# Altium schematic sheet support.SchDoc: Support
size A4; DrawnBy: Adrianna Ascalon
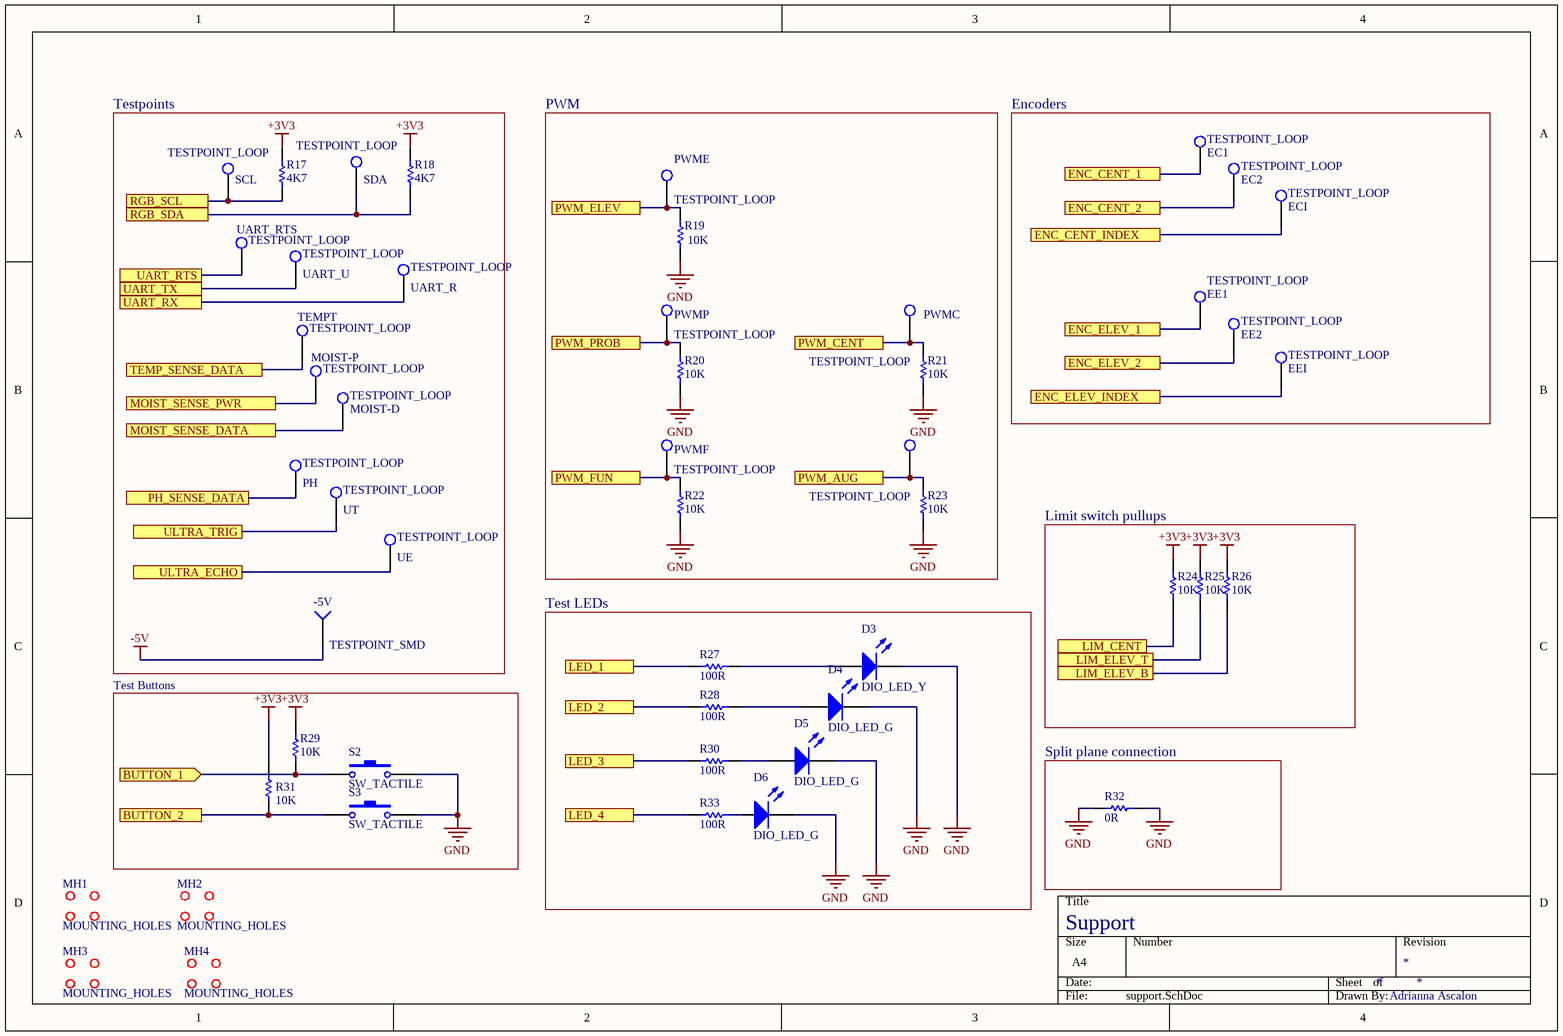
[diagram p0: support.SchDoc]

## Parts
-5V  TESTPOINT_SMD  [TESTPOINT]
D3  DIO_LED_Y  [LED_0805_LINE]
D4  DIO_LED_G  [LED_0805_LINE]
D5  DIO_LED_G  [LED_0805_LINE]
D6  DIO_LED_G  [LED_0805_LINE]
EC1  TESTPOINT_LOOP  [TESTPOINT_LOOP]
EC2  TESTPOINT_LOOP  [TESTPOINT_LOOP]
ECI  TESTPOINT_LOOP  [TESTPOINT_LOOP]
EE1  TESTPOINT_LOOP  [TESTPOINT_LOOP]
EE2  TESTPOINT_LOOP  [TESTPOINT_LOOP]
EEI  TESTPOINT_LOOP  [TESTPOINT_LOOP]
MH1  MOUNTING_HOLES  [MOUNTING_HOLE]
MH2  MOUNTING_HOLES  [MOUNTING_HOLE]
MH3  MOUNTING_HOLES  [MOUNTING_HOLE]
MH4  MOUNTING_HOLES  [MOUNTING_HOLE]
MOIST-D  TESTPOINT_LOOP  [TESTPOINT_LOOP]
MOIST-P  TESTPOINT_LOOP  [TESTPOINT_LOOP]
PH  TESTPOINT_LOOP  [TESTPOINT_LOOP]
PWMA  TESTPOINT_LOOP  [TESTPOINT_LOOP]
PWMC  TESTPOINT_LOOP  [TESTPOINT_LOOP]
PWME  TESTPOINT_LOOP  [TESTPOINT_LOOP]
PWMF  TESTPOINT_LOOP  [TESTPOINT_LOOP]
PWMP  TESTPOINT_LOOP  [TESTPOINT_LOOP]
R17  value 4K7  [RESC0603(1608)_N]  (hidden comment: RES_4K7_0603)
R18  value 4K7  [RESC0603(1608)_N]  (hidden comment: RES_4K7_0603)
R19  value 10K  [RESC0603(1608)_N]  (hidden comment: RES_10K_0603)
R20  value 10K  [RESC0603(1608)_N]  (hidden comment: RES_10K_0603)
R21  value 10K  [RESC0603(1608)_N]  (hidden comment: RES_10K_0603)
R22  value 10K  [RESC0603(1608)_N]  (hidden comment: RES_10K_0603)
R23  value 10K  [RESC0603(1608)_N]  (hidden comment: RES_10K_0603)
R24  value 10K  [RESC0603(1608)_N]  (hidden comment: RES_10K_0603)
R25  value 10K  [RESC0603(1608)_N]  (hidden comment: RES_10K_0603)
R26  value 10K  [RESC0603(1608)_N]  (hidden comment: RES_10K_0603)
R27  value 100R  [RESC0603(1608)_N]  (hidden comment: RES_100R_0603)
R28  value 100R  [RESC0603(1608)_N]  (hidden comment: RES_100R_0603)
R29  value 10K  [RESC0603(1608)_N]  (hidden comment: RES_10K_0603)
R30  value 100R  [RESC0603(1608)_N]  (hidden comment: RES_100R_0603)
R31  value 10K  [RESC0603(1608)_N]  (hidden comment: RES_10K_0603)
R32  value 0R  [RESC0603(1608)_N]  (hidden comment: RES_0R_0603)
R33  value 100R  [RESC0603(1608)_N]  (hidden comment: RES_100R_0603)
S2  SW_TACTILE  [B3U-1100P]
S3  SW_TACTILE  [B3U-1100P]
SCL  TESTPOINT_LOOP  [TESTPOINT_LOOP]
SDA  TESTPOINT_LOOP  [TESTPOINT_LOOP]
TEMPT  TESTPOINT_LOOP  [TESTPOINT_LOOP]
UART_R  TESTPOINT_LOOP  [TESTPOINT_LOOP]
UART_RTS  TESTPOINT_LOOP  [TESTPOINT_LOOP]
UART_U  TESTPOINT_LOOP  [TESTPOINT_LOOP]
UE  TESTPOINT_LOOP  [TESTPOINT_LOOP]
UT  TESTPOINT_LOOP  [TESTPOINT_LOOP]

## Blocks framed on the sheet
Testpoints: -5V MOIST-D MOIST-P PH R17 R18 SCL SDA TEMPT UART_R UART_RTS UART_U UE UT
PWM: PWMA PWMC PWME PWMF PWMP R19-R23
Encoders: EC1 EC2 ECI EE1 EE2 EEI
Limit switch pullups: R24-R26
Test LEDs: D3-D6 R27 R28 R30 R33
Test Buttons: R29 R31 S2 S3
Split plane connection: R32

## Ports
BUTTON_1 (in), BUTTON_2, ENC_CENT_1, ENC_CENT_2, ENC_CENT_INDEX, ENC_ELEV_1, ENC_ELEV_2, ENC_ELEV_INDEX, LED_1, LED_2, LED_3, LED_4, LIM_CENT, LIM_ELEV_B, LIM_ELEV_T, MOIST_SENSE_DATA, MOIST_SENSE_PWR, PH_SENSE_DATA, PWM_AUG, PWM_CENT, PWM_ELEV, PWM_FUN, PWM_PROB, RGB_SCL, RGB_SDA, TEMP_SENSE_DATA, UART_RTS, UART_RX, UART_TX, ULTRA_ECHO, ULTRA_TRIG

## Nets
+3V3: R17.2 R18.2 R24.2 R25.2 R26.2 R29.2 R31.1
-5V: -5V.1(=value)
GND: D3.2(K) D4.2(K) D5.2(K) D6.2(K) R19.1 R20.1 R21.1 R22.1 R23.1 R32.1 R32.2 S2.2 S3.2
BUTTON_1: R29.1 S2.1 ; port BUTTON_1
BUTTON_2: R31.2 S3.1 ; port BUTTON_2
ENC_CENT_1: EC1.1(=value) ; port ENC_CENT_1
ENC_CENT_2: EC2.1(=value) ; port ENC_CENT_2
ENC_CENT_INDEX: ECI.1(=value) ; port ENC_CENT_INDEX
ENC_ELEV_1: EE1.1(=value) ; port ENC_ELEV_1
ENC_ELEV_2: EE2.1(=value) ; port ENC_ELEV_2
ENC_ELEV_INDEX: EEI.1(=value) ; port ENC_ELEV_INDEX
LED_1: R27.1 ; port LED_1
LED_2: R28.1 ; port LED_2
LED_3: R30.1 ; port LED_3
LED_4: R33.1 ; port LED_4
LIM_CENT: R24.1 ; port LIM_CENT
LIM_ELEV_B: R26.1 ; port LIM_ELEV_B
LIM_ELEV_T: R25.1 ; port LIM_ELEV_T
MOIST_SENSE_DATA: MOIST-D.1(=value) ; port MOIST_SENSE_DATA
MOIST_SENSE_PWR: MOIST-P.1(=value) ; port MOIST_SENSE_PWR
PH_SENSE_DATA: PH.1(=value) ; port PH_SENSE_DATA
PWM_AUG: PWMA.1(=value) R23.2 ; port PWM_AUG
PWM_CENT: PWMC.1(=value) R21.2 ; port PWM_CENT
PWM_ELEV: PWME.1(=value) R19.2 ; port PWM_ELEV
PWM_FUN: PWMF.1(=value) R22.2 ; port PWM_FUN
PWM_PROB: PWMP.1(=value) R20.2 ; port PWM_PROB
RGB_SCL: R17.1 SCL.1(=value) ; port RGB_SCL
RGB_SDA: R18.1 SDA.1(=value) ; port RGB_SDA
TEMP_SENSE_DATA: TEMPT.1(=value) ; port TEMP_SENSE_DATA
UART_RTS: UART_RTS.1(=value) ; port UART_RTS
UART_RX: UART_R.1(=value) ; port UART_RX
UART_TX: UART_U.1(=value) ; port UART_TX
ULTRA_ECHO: UE.1(=value) ; port ULTRA_ECHO
ULTRA_TRIG: UT.1(=value) ; port ULTRA_TRIG
NetD3_1: D3.1(A) R27.2
NetD4_1: D4.1(A) R28.2
NetD5_1: D5.1(A) R30.2
NetD6_1: D6.1(A) R33.2

## Library data of the parts
D3 = DIO_LED_Y: LED YELLOW DIFFUSED 0805 SMD; Manufacturer: OSRAM; MPN: LY R976-PS-36; Forward Voltage Drop: 2.2V; Package: 0805 (2012 Metric); Digikey Part Number: 475-2560-1-ND
D4-D6 = DIO_LED_G: LED GREEN DIFFUSED 0805 SMD; Manufacturer: OSRAM; MPN: LG R971-KN-1; Forward Voltage Drop: 2.2V; Package: 0805 (2012 Metric); Digikey Part Number: 475-1410-1-ND
MH1-MH4 = MOUNTING_HOLES: 6cm x 6cm
R17 R18 = RES_4K7_0603: RES SMD 4.7K OHM 5% 1/10W 0603; Manufacturer: Yageo; MPN: RC0603JR-074K7L; Package: 0603 (1608 Metric); Dimensions: 0.063" L x 0.031" W (1.60mm x 0.80mm); Tolerance: 5%; Digikey Part Number: 311-4.7KGRCT-ND
R19-R26 R29 R31 = RES_10K_0603: RES SMD 10K OHM 5% 1/10W 0603; Manufacturer: Yageo; MPN: RC0603JR-0710KL; Package: 0603 (1608 Metric); Dimensions: 0.063" L x 0.031" W (1.60mm x 0.80mm); Tolerance: 5%; Digikey Part Number: 311-10KGRCT-ND
R27 R28 R30 R33 = RES_100R_0603: RES SMD 100 OHM 1% 1/10W 0603; Manufacturer: Yageo; MPN: RC0603FR-07100RL; Package: 0603 (1608 Metric); Dimensions: 0.063" L x 0.031" W (1.60mm x 0.80mm); Tolerance: 1%; Digikey Part Number: 311-100HRCT-ND
R32 = RES_0R_0603: RES SMD 0 OHM JUMPER 1/10W 0603; Manufacturer: Yageo; MPN: RC0603JR-070RL; Package: 0603 (1608 Metric); Dimensions: 0.063" L x 0.031" W (1.60mm x 0.80mm); Digikey Part Number: 311-0.0GRCT-ND
S2 S3 = SW_TACTILE: Tactile Switch (Grey); Manufacturer: Omron Electronics Inc-EMC Div; Digikey Part Number: SW1021TR-ND; MPN: B3U-1100P
-5V = TESTPOINT_SMD: Part Number (MPN): *